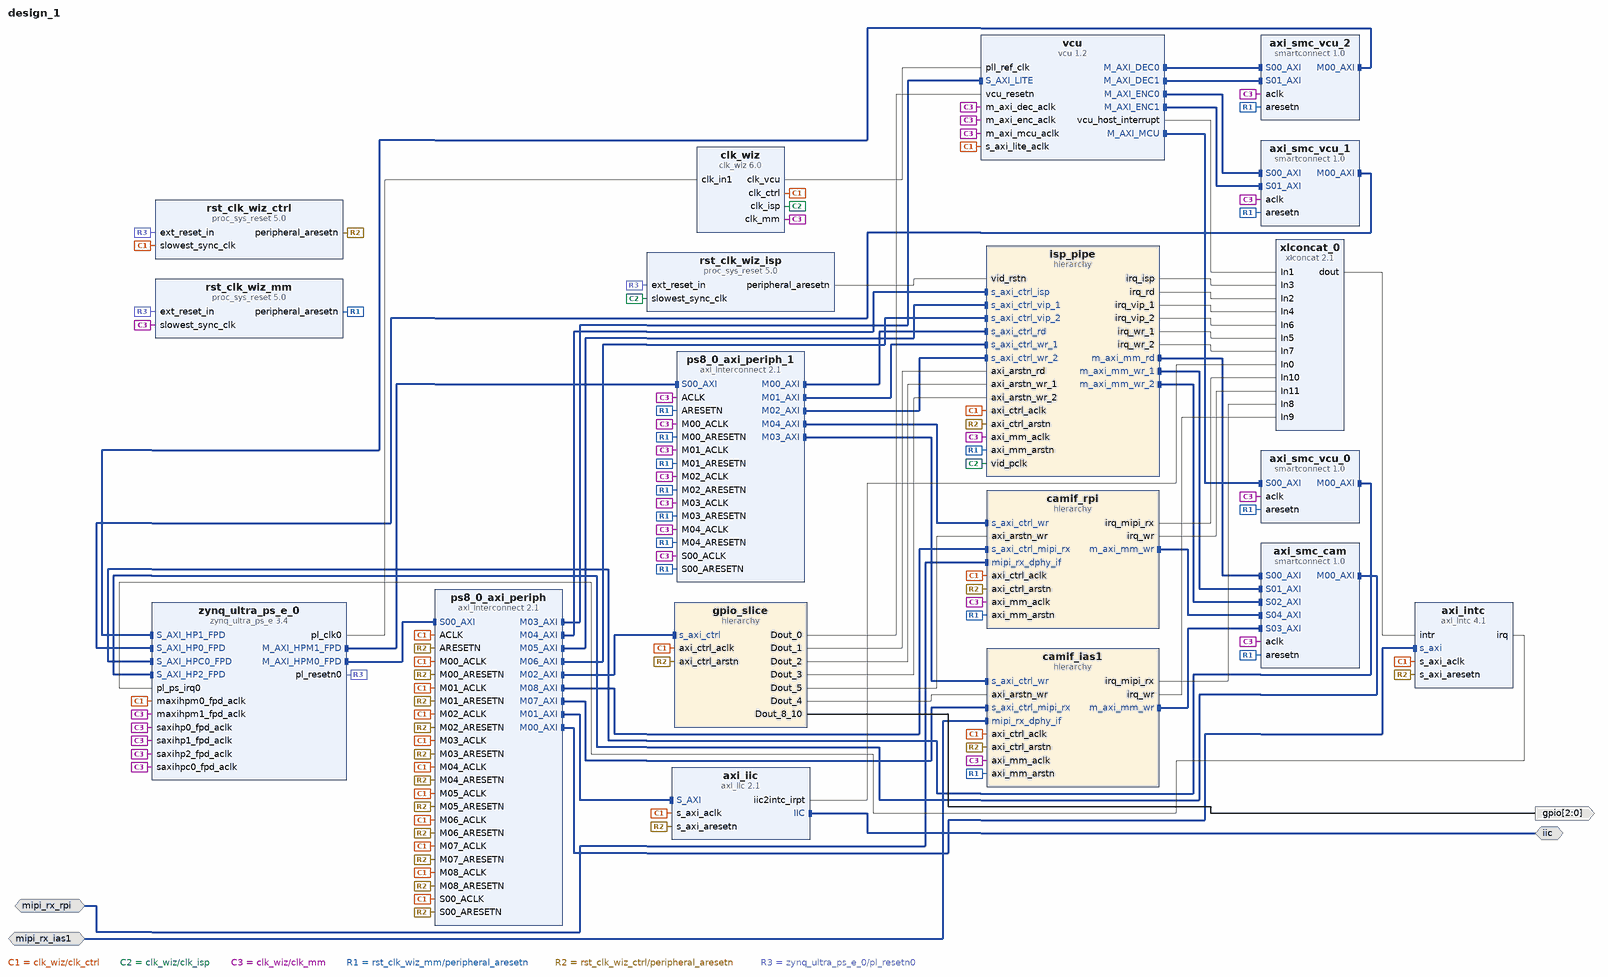
[diagram p0: block diagram of the top level]
# Vivado block design design_1, xck26-sfvc784-2LV-c, Vivado 2022.1
create_bd_design design_1

create_bd_intf_port -mode Master -vlnv xilinx.com:interface:iic_rtl:1.0 iic
create_bd_intf_port -mode Slave -vlnv xilinx.com:interface:mipi_phy_rtl:1.0 mipi_rx_ias1
create_bd_intf_port -mode Slave -vlnv xilinx.com:interface:mipi_phy_rtl:1.0 mipi_rx_rpi
create_bd_port -dir O -from 2 -to 0 gpio

create_bd_cell -type ip -vlnv xilinx.com:ip:xlconcat:2.1 xlconcat_0
set_property -dict {CONFIG.NUM_PORTS 12} [get_bd_cells xlconcat_0]
create_bd_cell -type hier camif_ias1
create_bd_cell -type hier isp_pipe
create_bd_cell -type hier camif_rpi
create_bd_cell -type ip -vlnv xilinx.com:ip:axi_intc:4.1 axi_intc
create_bd_cell -type ip -vlnv xilinx.com:ip:axi_iic:2.1 axi_iic
create_bd_cell -type ip -vlnv xilinx.com:ip:zynq_ultra_ps_e:3.4 zynq_ultra_ps_e_0
set_property -dict [list \
  CONFIG.CAN0_BOARD_INTERFACE custom \
  CONFIG.CAN1_BOARD_INTERFACE custom \
  CONFIG.CSU_BOARD_INTERFACE custom \
  CONFIG.DP_BOARD_INTERFACE custom \
  CONFIG.GEM0_BOARD_INTERFACE custom \
  CONFIG.GEM1_BOARD_INTERFACE custom \
  CONFIG.GEM2_BOARD_INTERFACE custom \
  CONFIG.GEM3_BOARD_INTERFACE custom \
  CONFIG.GPIO_BOARD_INTERFACE custom \
  CONFIG.IIC0_BOARD_INTERFACE custom \
  CONFIG.IIC1_BOARD_INTERFACE custom \
  CONFIG.NAND_BOARD_INTERFACE custom \
  CONFIG.PCIE_BOARD_INTERFACE custom \
  CONFIG.PJTAG_BOARD_INTERFACE custom \
  CONFIG.PMU_BOARD_INTERFACE custom \
  CONFIG.PSU_BANK_0_IO_STANDARD LVCMOS18 \
  CONFIG.PSU_BANK_1_IO_STANDARD LVCMOS18 \
  CONFIG.PSU_BANK_2_IO_STANDARD LVCMOS18 \
  CONFIG.PSU_BANK_3_IO_STANDARD LVCMOS18 \
  CONFIG.PSU_USB3__DUAL_CLOCK_ENABLE 1 \
  CONFIG.PSU__CAN1__PERIPHERAL__ENABLE 0 \
  CONFIG.PSU__CRF_APB__ACPU_CTRL__FREQMHZ 1333.333 \
  CONFIG.PSU__CRF_APB__ACPU_CTRL__SRCSEL APLL \
  CONFIG.PSU__CRF_APB__APLL_CTRL__SRCSEL PSS_REF_CLK \
  CONFIG.PSU__CRF_APB__APLL_FRAC_CFG__ENABLED 1 \
  CONFIG.PSU__CRF_APB__DBG_FPD_CTRL__FREQMHZ 250 \
  CONFIG.PSU__CRF_APB__DBG_FPD_CTRL__SRCSEL IOPLL \
  CONFIG.PSU__CRF_APB__DBG_TRACE_CTRL__FREQMHZ 250 \
  CONFIG.PSU__CRF_APB__DBG_TRACE_CTRL__SRCSEL IOPLL \
  CONFIG.PSU__CRF_APB__DBG_TSTMP_CTRL__FREQMHZ 250 \
  CONFIG.PSU__CRF_APB__DBG_TSTMP_CTRL__SRCSEL IOPLL \
  CONFIG.PSU__CRF_APB__DDR_CTRL__FREQMHZ 1200 \
  CONFIG.PSU__CRF_APB__DDR_CTRL__SRCSEL DPLL \
  CONFIG.PSU__CRF_APB__DPDMA_REF_CTRL__FREQMHZ 600 \
  CONFIG.PSU__CRF_APB__DPDMA_REF_CTRL__SRCSEL APLL \
  CONFIG.PSU__CRF_APB__DPLL_CTRL__SRCSEL PSS_REF_CLK \
  CONFIG.PSU__CRF_APB__DP_AUDIO_REF_CTRL__SRCSEL RPLL \
  CONFIG.PSU__CRF_APB__DP_STC_REF_CTRL__SRCSEL RPLL \
  CONFIG.PSU__CRF_APB__DP_VIDEO_REF_CTRL__SRCSEL VPLL \
  CONFIG.PSU__CRF_APB__GDMA_REF_CTRL__FREQMHZ 600 \
  CONFIG.PSU__CRF_APB__GDMA_REF_CTRL__SRCSEL DPLL \
  CONFIG.PSU__CRF_APB__GPU_REF_CTRL__FREQMHZ 600 \
  CONFIG.PSU__CRF_APB__GPU_REF_CTRL__SRCSEL IOPLL \
  CONFIG.PSU__CRF_APB__TOPSW_LSBUS_CTRL__FREQMHZ 100 \
  CONFIG.PSU__CRF_APB__TOPSW_LSBUS_CTRL__SRCSEL IOPLL \
  CONFIG.PSU__CRF_APB__TOPSW_MAIN_CTRL__FREQMHZ 533.33 \
  CONFIG.PSU__CRF_APB__TOPSW_MAIN_CTRL__SRCSEL DPLL \
  CONFIG.PSU__CRF_APB__VPLL_CTRL__SRCSEL PSS_REF_CLK \
  CONFIG.PSU__CRL_APB__ADMA_REF_CTRL__FREQMHZ 500 \
  CONFIG.PSU__CRL_APB__ADMA_REF_CTRL__SRCSEL IOPLL \
  CONFIG.PSU__CRL_APB__CAN1_REF_CTRL__FREQMHZ 100 \
  CONFIG.PSU__CRL_APB__CAN1_REF_CTRL__SRCSEL IOPLL \
  CONFIG.PSU__CRL_APB__CPU_R5_CTRL__FREQMHZ 533.333 \
  CONFIG.PSU__CRL_APB__CPU_R5_CTRL__SRCSEL RPLL \
  CONFIG.PSU__CRL_APB__DBG_LPD_CTRL__FREQMHZ 250 \
  CONFIG.PSU__CRL_APB__DBG_LPD_CTRL__SRCSEL IOPLL \
  CONFIG.PSU__CRL_APB__GEM3_REF_CTRL__FREQMHZ 125 \
  CONFIG.PSU__CRL_APB__GEM3_REF_CTRL__SRCSEL IOPLL \
  CONFIG.PSU__CRL_APB__I2C0_REF_CTRL__FREQMHZ 100 \
  CONFIG.PSU__CRL_APB__I2C0_REF_CTRL__SRCSEL IOPLL \
  CONFIG.PSU__CRL_APB__I2C1_REF_CTRL__FREQMHZ 100 \
  CONFIG.PSU__CRL_APB__I2C1_REF_CTRL__SRCSEL IOPLL \
  CONFIG.PSU__CRL_APB__IOPLL_CTRL__SRCSEL PSS_REF_CLK \
  CONFIG.PSU__CRL_APB__IOU_SWITCH_CTRL__FREQMHZ 250 \
  CONFIG.PSU__CRL_APB__IOU_SWITCH_CTRL__SRCSEL IOPLL \
  CONFIG.PSU__CRL_APB__LPD_LSBUS_CTRL__FREQMHZ 100 \
  CONFIG.PSU__CRL_APB__LPD_LSBUS_CTRL__SRCSEL IOPLL \
  CONFIG.PSU__CRL_APB__LPD_SWITCH_CTRL__FREQMHZ 500 \
  CONFIG.PSU__CRL_APB__LPD_SWITCH_CTRL__SRCSEL IOPLL \
  CONFIG.PSU__CRL_APB__PCAP_CTRL__FREQMHZ 200 \
  CONFIG.PSU__CRL_APB__PCAP_CTRL__SRCSEL IOPLL \
  CONFIG.PSU__CRL_APB__PL0_REF_CTRL__FREQMHZ 100 \
  CONFIG.PSU__CRL_APB__PL0_REF_CTRL__SRCSEL IOPLL \
  CONFIG.PSU__CRL_APB__QSPI_REF_CTRL__FREQMHZ 125 \
  CONFIG.PSU__CRL_APB__QSPI_REF_CTRL__SRCSEL IOPLL \
  CONFIG.PSU__CRL_APB__RPLL_CTRL__SRCSEL PSS_REF_CLK \
  CONFIG.PSU__CRL_APB__SDIO1_REF_CTRL__FREQMHZ 200 \
  CONFIG.PSU__CRL_APB__SDIO1_REF_CTRL__SRCSEL IOPLL \
  CONFIG.PSU__CRL_APB__SPI1_REF_CTRL__SRCSEL IOPLL \
  CONFIG.PSU__CRL_APB__TIMESTAMP_REF_CTRL__FREQMHZ 100 \
  CONFIG.PSU__CRL_APB__TIMESTAMP_REF_CTRL__SRCSEL IOPLL \
  CONFIG.PSU__CRL_APB__UART0_REF_CTRL__FREQMHZ 100 \
  CONFIG.PSU__CRL_APB__UART0_REF_CTRL__SRCSEL IOPLL \
  CONFIG.PSU__CRL_APB__UART1_REF_CTRL__FREQMHZ 100 \
  CONFIG.PSU__CRL_APB__UART1_REF_CTRL__SRCSEL IOPLL \
  CONFIG.PSU__CRL_APB__USB0_BUS_REF_CTRL__FREQMHZ 250 \
  CONFIG.PSU__CRL_APB__USB0_BUS_REF_CTRL__SRCSEL IOPLL \
  CONFIG.PSU__CRL_APB__USB3_DUAL_REF_CTRL__FREQMHZ 20 \
  CONFIG.PSU__CRL_APB__USB3_DUAL_REF_CTRL__SRCSEL IOPLL \
  CONFIG.PSU__CRL_APB__USB3__ENABLE 1 \
  CONFIG.PSU__CSUPMU__PERIPHERAL__VALID 1 \
  CONFIG.PSU__DDRC__BUS_WIDTH {64 Bit} \
  CONFIG.PSU__DDRC__COMPONENTS Components \
  CONFIG.PSU__DDRC__DEVICE_CAPACITY {8192 MBits} \
  CONFIG.PSU__DDRC__DRAM_WIDTH {16 Bits} \
  CONFIG.PSU__DDRC__ECC Disabled \
  CONFIG.PSU__DDRC__MEMORY_TYPE {DDR 4} \
  CONFIG.PSU__DDRC__SPEED_BIN DDR4_2400R \
  CONFIG.PSU__DDR_HIGH_ADDRESS_GUI_ENABLE 1 \
  CONFIG.PSU__DDR__INTERFACE__FREQMHZ 600.000 \
  CONFIG.PSU__DEVICE_TYPE EV \
  CONFIG.PSU__DISPLAYPORT__LANE0__ENABLE 1 \
  CONFIG.PSU__DISPLAYPORT__LANE0__IO {GT Lane1} \
  CONFIG.PSU__DISPLAYPORT__LANE1__ENABLE 1 \
  CONFIG.PSU__DISPLAYPORT__LANE1__IO {GT Lane0} \
  CONFIG.PSU__DISPLAYPORT__PERIPHERAL__ENABLE 1 \
  CONFIG.PSU__DLL__ISUSED 1 \
  CONFIG.PSU__DPAUX__PERIPHERAL__ENABLE 1 \
  CONFIG.PSU__DPAUX__PERIPHERAL__IO {MIO 27 .. 30} \
  CONFIG.PSU__DP__LANE_SEL {Dual Lower} \
  CONFIG.PSU__DP__REF_CLK_FREQ 27 \
  CONFIG.PSU__DP__REF_CLK_SEL {Ref Clk0} \
  CONFIG.PSU__ENET3__FIFO__ENABLE 0 \
  CONFIG.PSU__ENET3__GRP_MDIO__ENABLE 1 \
  CONFIG.PSU__ENET3__GRP_MDIO__IO {MIO 76 .. 77} \
  CONFIG.PSU__ENET3__PERIPHERAL__ENABLE 1 \
  CONFIG.PSU__ENET3__PERIPHERAL__IO {MIO 64 .. 75} \
  CONFIG.PSU__ENET3__PTP__ENABLE 0 \
  CONFIG.PSU__ENET3__TSU__ENABLE 0 \
  CONFIG.PSU__FPGA_PL0_ENABLE 1 \
  CONFIG.PSU__GEM3_COHERENCY 0 \
  CONFIG.PSU__GEM3_ROUTE_THROUGH_FPD 0 \
  CONFIG.PSU__GEM__TSU__ENABLE 0 \
  CONFIG.PSU__GPIO0_MIO__IO {MIO 0 .. 25} \
  CONFIG.PSU__GPIO0_MIO__PERIPHERAL__ENABLE 1 \
  CONFIG.PSU__GPIO1_MIO__IO {MIO 26 .. 51} \
  CONFIG.PSU__GPIO1_MIO__PERIPHERAL__ENABLE 1 \
  CONFIG.PSU__GPIO_EMIO_WIDTH 3 \
  CONFIG.PSU__GT__LINK_SPEED HBR \
  CONFIG.PSU__GT__PRE_EMPH_LVL_4 0 \
  CONFIG.PSU__GT__VLT_SWNG_LVL_4 0 \
  CONFIG.PSU__I2C0__PERIPHERAL__ENABLE 0 \
  CONFIG.PSU__I2C1__PERIPHERAL__ENABLE 1 \
  CONFIG.PSU__I2C1__PERIPHERAL__IO {MIO 24 .. 25} \
  CONFIG.PSU__IOU_SLCR__IOU_TTC_APB_CLK__TTC0_SEL APB \
  CONFIG.PSU__IOU_SLCR__IOU_TTC_APB_CLK__TTC1_SEL APB \
  CONFIG.PSU__IOU_SLCR__IOU_TTC_APB_CLK__TTC2_SEL APB \
  CONFIG.PSU__IOU_SLCR__IOU_TTC_APB_CLK__TTC3_SEL APB \
  CONFIG.PSU__MAXIGP0__DATA_WIDTH 128 \
  CONFIG.PSU__OVERRIDE_HPX_QOS 0 \
  CONFIG.PSU__OVERRIDE__BASIC_CLOCK 0 \
  CONFIG.PSU__PMU_COHERENCY 0 \
  CONFIG.PSU__PMU__AIBACK__ENABLE 0 \
  CONFIG.PSU__PMU__EMIO_GPI__ENABLE 0 \
  CONFIG.PSU__PMU__EMIO_GPO__ENABLE 0 \
  CONFIG.PSU__PMU__GPI0__ENABLE 1 \
  CONFIG.PSU__PMU__GPI0__IO {MIO 26} \
  CONFIG.PSU__PMU__GPI1__ENABLE 0 \
  CONFIG.PSU__PMU__GPI2__ENABLE 0 \
  CONFIG.PSU__PMU__GPI3__ENABLE 0 \
  CONFIG.PSU__PMU__GPI4__ENABLE 0 \
  CONFIG.PSU__PMU__GPI5__ENABLE 1 \
  CONFIG.PSU__PMU__GPI5__IO {MIO 31} \
  CONFIG.PSU__PMU__GPO0__ENABLE 1 \
  CONFIG.PSU__PMU__GPO0__IO {MIO 32} \
  CONFIG.PSU__PMU__GPO1__ENABLE 1 \
  CONFIG.PSU__PMU__GPO1__IO {MIO 33} \
  CONFIG.PSU__PMU__GPO2__ENABLE 1 \
  CONFIG.PSU__PMU__GPO2__IO {MIO 34} \
  CONFIG.PSU__PMU__GPO2__POLARITY high \
  CONFIG.PSU__PMU__GPO3__ENABLE 1 \
  CONFIG.PSU__PMU__GPO3__IO {MIO 35} \
  CONFIG.PSU__PMU__GPO3__POLARITY low \
  CONFIG.PSU__PMU__GPO4__ENABLE 0 \
  CONFIG.PSU__PMU__GPO5__ENABLE 0 \
  CONFIG.PSU__PMU__PERIPHERAL__ENABLE 1 \
  CONFIG.PSU__PMU__PLERROR__ENABLE 0 \
  CONFIG.PSU__PRESET_APPLIED 1 \
  CONFIG.PSU__PSS_REF_CLK__FREQMHZ 33.333 \
  CONFIG.PSU__QSPI_COHERENCY 0 \
  CONFIG.PSU__QSPI_ROUTE_THROUGH_FPD 0 \
  CONFIG.PSU__QSPI__GRP_FBCLK__ENABLE 0 \
  CONFIG.PSU__QSPI__PERIPHERAL__DATA_MODE x4 \
  CONFIG.PSU__QSPI__PERIPHERAL__ENABLE 1 \
  CONFIG.PSU__QSPI__PERIPHERAL__IO {MIO 0 .. 5} \
  CONFIG.PSU__QSPI__PERIPHERAL__MODE Single \
  CONFIG.PSU__SATA__PERIPHERAL__ENABLE 0 \
  CONFIG.PSU__SD0__CLK_100_SDR_OTAP_DLY 0x00 \
  CONFIG.PSU__SD0__CLK_200_SDR_OTAP_DLY 0x00 \
  CONFIG.PSU__SD0__CLK_50_DDR_ITAP_DLY 0x00 \
  CONFIG.PSU__SD0__CLK_50_DDR_OTAP_DLY 0x00 \
  CONFIG.PSU__SD0__CLK_50_SDR_ITAP_DLY 0x00 \
  CONFIG.PSU__SD0__CLK_50_SDR_OTAP_DLY 0x00 \
  CONFIG.PSU__SD1_COHERENCY 0 \
  CONFIG.PSU__SD1_ROUTE_THROUGH_FPD 0 \
  CONFIG.PSU__SD1__CLK_100_SDR_OTAP_DLY 0x3 \
  CONFIG.PSU__SD1__CLK_200_SDR_OTAP_DLY 0x3 \
  CONFIG.PSU__SD1__CLK_50_DDR_ITAP_DLY 0x3D \
  CONFIG.PSU__SD1__CLK_50_DDR_OTAP_DLY 0x4 \
  CONFIG.PSU__SD1__CLK_50_SDR_ITAP_DLY 0x15 \
  CONFIG.PSU__SD1__CLK_50_SDR_OTAP_DLY 0x5 \
  CONFIG.PSU__SD1__DATA_TRANSFER_MODE 8Bit \
  CONFIG.PSU__SD1__GRP_CD__ENABLE 1 \
  CONFIG.PSU__SD1__GRP_CD__IO {MIO 45} \
  CONFIG.PSU__SD1__GRP_POW__ENABLE 1 \
  CONFIG.PSU__SD1__GRP_POW__IO {MIO 43} \
  CONFIG.PSU__SD1__GRP_WP__ENABLE 0 \
  CONFIG.PSU__SD1__PERIPHERAL__ENABLE 1 \
  CONFIG.PSU__SD1__PERIPHERAL__IO {MIO 39 .. 51} \
  CONFIG.PSU__SD1__SLOT_TYPE {SD 3.0} \
  CONFIG.PSU__SPI1__GRP_SS0__IO {MIO 9} \
  CONFIG.PSU__SPI1__PERIPHERAL__ENABLE 1 \
  CONFIG.PSU__SPI1__PERIPHERAL__IO {MIO 6 .. 11} \
  CONFIG.PSU__SWDT0__CLOCK__ENABLE 0 \
  CONFIG.PSU__SWDT0__PERIPHERAL__ENABLE 1 \
  CONFIG.PSU__SWDT0__RESET__ENABLE 0 \
  CONFIG.PSU__SWDT1__CLOCK__ENABLE 0 \
  CONFIG.PSU__SWDT1__PERIPHERAL__ENABLE 1 \
  CONFIG.PSU__SWDT1__RESET__ENABLE 0 \
  CONFIG.PSU__TSU__BUFG_PORT_PAIR 0 \
  CONFIG.PSU__TTC0__CLOCK__ENABLE 0 \
  CONFIG.PSU__TTC0__PERIPHERAL__ENABLE 1 \
  CONFIG.PSU__TTC0__WAVEOUT__ENABLE 0 \
  CONFIG.PSU__TTC1__CLOCK__ENABLE 0 \
  CONFIG.PSU__TTC1__PERIPHERAL__ENABLE 1 \
  CONFIG.PSU__TTC1__WAVEOUT__ENABLE 0 \
  CONFIG.PSU__TTC2__CLOCK__ENABLE 0 \
  CONFIG.PSU__TTC2__PERIPHERAL__ENABLE 1 \
  CONFIG.PSU__TTC2__WAVEOUT__ENABLE 0 \
  CONFIG.PSU__TTC3__CLOCK__ENABLE 0 \
  CONFIG.PSU__TTC3__PERIPHERAL__ENABLE 1 \
  CONFIG.PSU__TTC3__WAVEOUT__ENABLE 0 \
  CONFIG.PSU__UART0__PERIPHERAL__ENABLE 0 \
  CONFIG.PSU__UART1__BAUD_RATE 115200 \
  CONFIG.PSU__UART1__MODEM__ENABLE 0 \
  CONFIG.PSU__UART1__PERIPHERAL__ENABLE 1 \
  CONFIG.PSU__UART1__PERIPHERAL__IO {MIO 36 .. 37} \
  CONFIG.PSU__USB0_COHERENCY 0 \
  CONFIG.PSU__USB0__PERIPHERAL__ENABLE 1 \
  CONFIG.PSU__USB0__PERIPHERAL__IO {MIO 52 .. 63} \
  CONFIG.PSU__USB0__REF_CLK_FREQ 26 \
  CONFIG.PSU__USB0__REF_CLK_SEL {Ref Clk1} \
  CONFIG.PSU__USB2_0__EMIO__ENABLE 0 \
  CONFIG.PSU__USB3_0__EMIO__ENABLE 0 \
  CONFIG.PSU__USB3_0__PERIPHERAL__ENABLE 1 \
  CONFIG.PSU__USB3_0__PERIPHERAL__IO {GT Lane2} \
  CONFIG.PSU__USB__RESET__MODE {Boot Pin} \
  CONFIG.PSU__USB__RESET__POLARITY {Active Low} \
  CONFIG.PSU__USE__IRQ0 1 \
  CONFIG.PSU__USE__M_AXI_GP0 1 \
  CONFIG.PSU__USE__M_AXI_GP1 1 \
  CONFIG.PSU__USE__M_AXI_GP2 0 \
  CONFIG.PSU__USE__S_AXI_GP0 1 \
  CONFIG.PSU__USE__S_AXI_GP2 1 \
  CONFIG.PSU__USE__S_AXI_GP3 1 \
  CONFIG.PSU__USE__S_AXI_GP4 1 \
  CONFIG.QSPI_BOARD_INTERFACE custom \
  CONFIG.SATA_BOARD_INTERFACE custom \
  CONFIG.SD0_BOARD_INTERFACE custom \
  CONFIG.SD1_BOARD_INTERFACE custom \
  CONFIG.SPI0_BOARD_INTERFACE custom \
  CONFIG.SPI1_BOARD_INTERFACE custom \
  CONFIG.SUBPRESET1 Custom \
  CONFIG.SUBPRESET2 Custom \
  CONFIG.SWDT0_BOARD_INTERFACE custom \
  CONFIG.SWDT1_BOARD_INTERFACE custom \
  CONFIG.TRACE_BOARD_INTERFACE custom \
  CONFIG.TTC0_BOARD_INTERFACE custom \
  CONFIG.TTC1_BOARD_INTERFACE custom \
  CONFIG.TTC2_BOARD_INTERFACE custom \
  CONFIG.TTC3_BOARD_INTERFACE custom \
  CONFIG.UART0_BOARD_INTERFACE custom \
  CONFIG.UART1_BOARD_INTERFACE custom \
  CONFIG.USB0_BOARD_INTERFACE custom \
  CONFIG.USB1_BOARD_INTERFACE custom \
] [get_bd_cells zynq_ultra_ps_e_0]
# 740 more settings of zynq_ultra_ps_e_0 are not shown: defaults, MIO pin electricals, DDR timing, and values the tool derives
create_bd_cell -type ip -vlnv xilinx.com:ip:clk_wiz:6.0 clk_wiz
set_property -dict [list \
  CONFIG.CLKOUT1_JITTER 96.285 \
  CONFIG.CLKOUT1_PHASE_ERROR 76.968 \
  CONFIG.CLKOUT1_REQUESTED_OUT_FREQ 100 \
  CONFIG.CLKOUT2_JITTER 79.342 \
  CONFIG.CLKOUT2_PHASE_ERROR 76.968 \
  CONFIG.CLKOUT2_REQUESTED_OUT_FREQ 300 \
  CONFIG.CLKOUT2_USED true \
  CONFIG.CLKOUT3_JITTER 92.549 \
  CONFIG.CLKOUT3_PHASE_ERROR 76.968 \
  CONFIG.CLKOUT3_REQUESTED_OUT_FREQ 125 \
  CONFIG.CLKOUT3_USED true \
  CONFIG.CLKOUT4_JITTER 117.170 \
  CONFIG.CLKOUT4_PHASE_ERROR 76.968 \
  CONFIG.CLKOUT4_REQUESTED_OUT_FREQ 33.3 \
  CONFIG.CLKOUT4_USED true \
  CONFIG.CLK_OUT1_PORT clk_ctrl \
  CONFIG.CLK_OUT2_PORT clk_mm \
  CONFIG.CLK_OUT3_PORT clk_isp \
  CONFIG.CLK_OUT4_PORT clk_vcu \
  CONFIG.MMCM_CLKFBOUT_MULT_F 15.000 \
  CONFIG.MMCM_CLKOUT0_DIVIDE_F 15.000 \
  CONFIG.MMCM_CLKOUT1_DIVIDE 5 \
  CONFIG.MMCM_CLKOUT2_DIVIDE 12 \
  CONFIG.MMCM_CLKOUT3_DIVIDE 45 \
  CONFIG.MMCM_DIVCLK_DIVIDE 1 \
  CONFIG.NUM_OUT_CLKS 4 \
  CONFIG.USE_LOCKED false \
  CONFIG.USE_RESET false \
] [get_bd_cells clk_wiz]
create_bd_cell -type hier gpio_slice
create_bd_cell -type ip -vlnv xilinx.com:ip:vcu:1.2 vcu
set_property -dict [list \
  CONFIG.DEC_CODING_TYPE 1 \
  CONFIG.DEC_COLOR_DEPTH 0 \
  CONFIG.DEC_COLOR_FORMAT 0 \
  CONFIG.ENC_BUFFER_EN true \
  CONFIG.ENC_BUFFER_SIZE_ACTUAL 392 \
  CONFIG.ENC_CODING_TYPE 1 \
  CONFIG.ENC_COLOR_DEPTH 0 \
  CONFIG.ENC_COLOR_FORMAT 0 \
  CONFIG.ENC_MEM_URAM_USED 392 \
  CONFIG.TABLE_NO 2 \
] [get_bd_cells vcu]
create_bd_cell -type ip -vlnv xilinx.com:ip:axi_interconnect:2.1 ps8_0_axi_periph
set_property -dict {CONFIG.NUM_MI 9} [get_bd_cells ps8_0_axi_periph]
create_bd_cell -type ip -vlnv xilinx.com:ip:proc_sys_reset:5.0 rst_clk_wiz_ctrl
create_bd_cell -type ip -vlnv xilinx.com:ip:smartconnect:1.0 axi_smc_vcu_0
set_property -dict {CONFIG.NUM_SI 1} [get_bd_cells axi_smc_vcu_0]
create_bd_cell -type ip -vlnv xilinx.com:ip:proc_sys_reset:5.0 rst_clk_wiz_mm
create_bd_cell -type ip -vlnv xilinx.com:ip:smartconnect:1.0 axi_smc_vcu_1
set_property -dict {CONFIG.NUM_SI 2} [get_bd_cells axi_smc_vcu_1]
create_bd_cell -type ip -vlnv xilinx.com:ip:smartconnect:1.0 axi_smc_vcu_2
set_property -dict {CONFIG.NUM_SI 2} [get_bd_cells axi_smc_vcu_2]
create_bd_cell -type ip -vlnv xilinx.com:ip:axi_interconnect:2.1 ps8_0_axi_periph_1
set_property -dict {CONFIG.NUM_MI 5} [get_bd_cells ps8_0_axi_periph_1]
create_bd_cell -type ip -vlnv xilinx.com:ip:smartconnect:1.0 axi_smc_cam
set_property -dict {CONFIG.NUM_CLKS 1 CONFIG.NUM_SI 5} [get_bd_cells axi_smc_cam]
create_bd_cell -type ip -vlnv xilinx.com:ip:proc_sys_reset:5.0 rst_clk_wiz_isp

# ---- hierarchy /camif_ias1 ----
current_bd_instance /camif_ias1
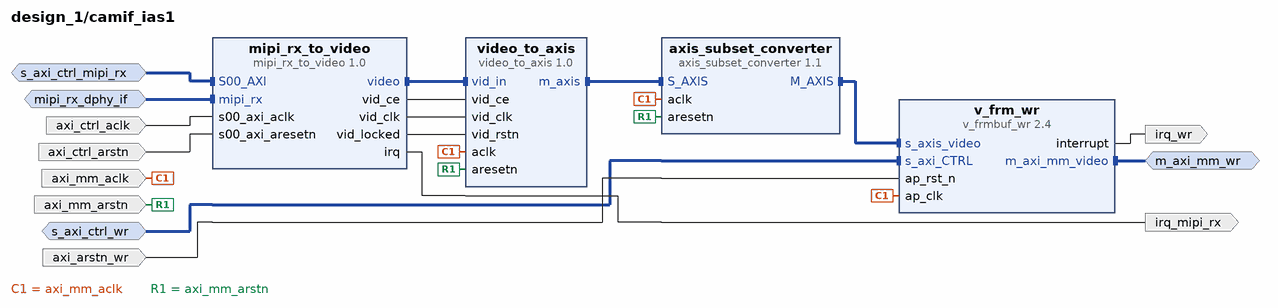
[diagram p1: block diagram inside /camif_ias1]
create_bd_intf_pin -mode Slave -vlnv xilinx.com:interface:mipi_phy_rtl:1.0 mipi_rx_dphy_if
create_bd_intf_pin -mode Slave -vlnv xilinx.com:interface:aximm_rtl:1.0 s_axi_ctrl_wr
create_bd_intf_pin -mode Master -vlnv xilinx.com:interface:aximm_rtl:1.0 m_axi_mm_wr
create_bd_intf_pin -mode Slave -vlnv xilinx.com:interface:aximm_rtl:1.0 s_axi_ctrl_mipi_rx
create_bd_pin -dir O -type intr irq_wr
create_bd_pin -dir I -type clk axi_ctrl_aclk
create_bd_pin -dir I -type rst axi_ctrl_arstn
create_bd_pin -dir O -type intr irq_mipi_rx
create_bd_pin -dir I -type rst axi_arstn_wr
create_bd_pin -dir I -type clk axi_mm_aclk
create_bd_pin -dir I -type rst axi_mm_arstn

create_bd_cell -type ip -vlnv xilinx.com:ip:axis_subset_converter:1.1 axis_subset_converter
set_property -dict [list \
  CONFIG.M_HAS_TLAST 1 \
  CONFIG.M_HAS_TREADY 1 \
  CONFIG.M_TDATA_NUM_BYTES 15 \
  CONFIG.M_TUSER_WIDTH 1 \
  CONFIG.S_HAS_TLAST 1 \
  CONFIG.S_HAS_TREADY 1 \
  CONFIG.S_TDATA_NUM_BYTES 5 \
  CONFIG.S_TUSER_WIDTH 1 \
  CONFIG.TDATA_REMAP {20'b0,tdata[39:30],20'b0,tdata[29:20],20'b0,tdata[19:10],20'b0,tdata[9:0]} \
  CONFIG.TLAST_REMAP {tlast[0]} \
  CONFIG.TUSER_REMAP {tuser[0:0]} \
] [get_bd_cells axis_subset_converter]
create_bd_cell -type ip -vlnv xilinx.com:ip:v_frmbuf_wr:2.4 v_frm_wr
set_property -dict [list \
  CONFIG.AXIMM_DATA_WIDTH 256 \
  CONFIG.C_M_AXI_MM_VIDEO_DATA_WIDTH 256 \
  CONFIG.HAS_BGR8 0 \
  CONFIG.HAS_BGRX8 0 \
  CONFIG.HAS_RGB8 0 \
  CONFIG.HAS_RGBX8 0 \
  CONFIG.HAS_Y8 1 \
  CONFIG.HAS_Y10 1 \
  CONFIG.MAX_COLS 4208 \
  CONFIG.MAX_DATA_WIDTH 10 \
  CONFIG.MAX_ROWS 3120 \
  CONFIG.SAMPLES_PER_CLOCK 4 \
] [get_bd_cells v_frm_wr]
create_bd_cell -type ip -vlnv bxq.com:user:mipi_rx_to_video:1.0 mipi_rx_to_video
set_property -dict [list \
  CONFIG.DATA_BITS 10 \
  CONFIG.DATA_DELAY_INSIDE true \
  CONFIG.DATA_DELAY_NTAPS 200 \
  CONFIG.HS_SETTLE_DELAY 20 \
  CONFIG.LANES_NUM 4 \
] [get_bd_cells mipi_rx_to_video]
create_bd_cell -type ip -vlnv bxq.com:user:video_to_axis:1.0 video_to_axis
set_property -dict {CONFIG.ADDR_BITS 10 CONFIG.DATA_BITS 40} [get_bd_cells video_to_axis]

# ---- hierarchy /isp_pipe ----
current_bd_instance /isp_pipe
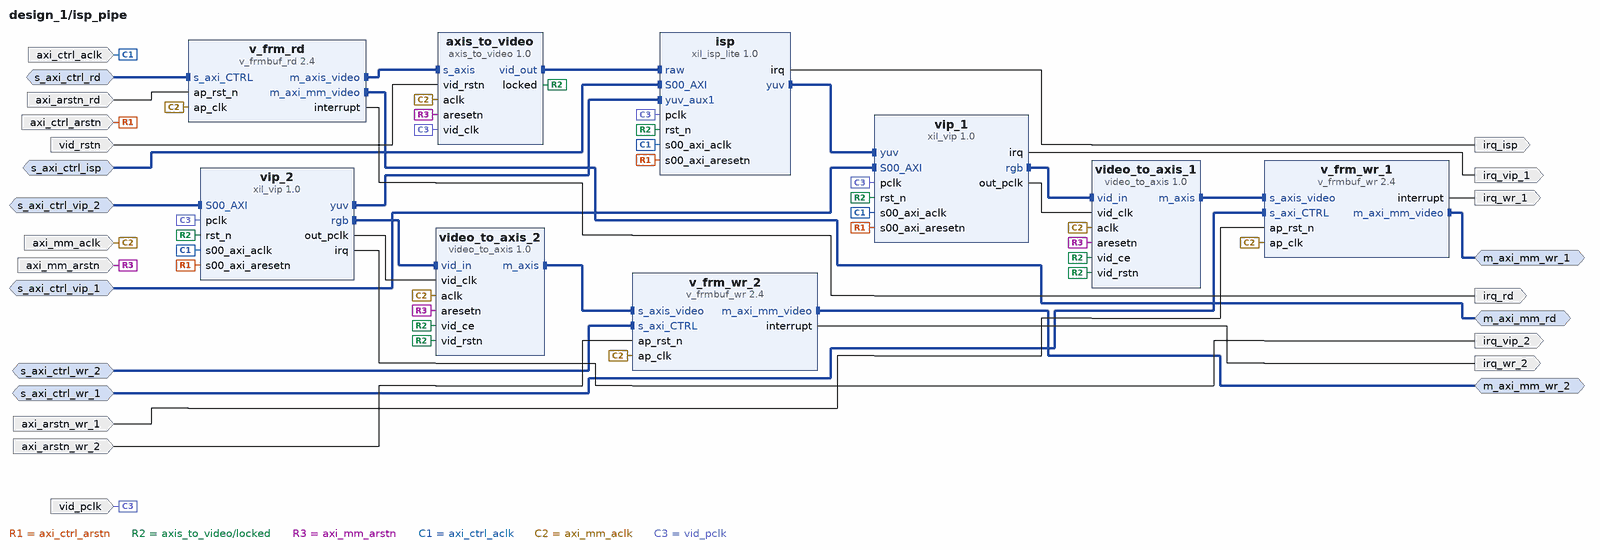
[diagram p2: block diagram inside /isp_pipe]
create_bd_intf_pin -mode Slave -vlnv xilinx.com:interface:aximm_rtl:1.0 s_axi_ctrl_vip_1
create_bd_intf_pin -mode Slave -vlnv xilinx.com:interface:aximm_rtl:1.0 s_axi_ctrl_rd
create_bd_intf_pin -mode Master -vlnv xilinx.com:interface:aximm_rtl:1.0 m_axi_mm_rd
create_bd_intf_pin -mode Slave -vlnv xilinx.com:interface:aximm_rtl:1.0 s_axi_ctrl_isp
create_bd_intf_pin -mode Slave -vlnv xilinx.com:interface:aximm_rtl:1.0 s_axi_ctrl_wr_1
create_bd_intf_pin -mode Master -vlnv xilinx.com:interface:aximm_rtl:1.0 m_axi_mm_wr_1
create_bd_intf_pin -mode Slave -vlnv xilinx.com:interface:aximm_rtl:1.0 s_axi_ctrl_vip_2
create_bd_intf_pin -mode Slave -vlnv xilinx.com:interface:aximm_rtl:1.0 s_axi_ctrl_wr_2
create_bd_intf_pin -mode Master -vlnv xilinx.com:interface:aximm_rtl:1.0 m_axi_mm_wr_2
create_bd_pin -dir I -type clk vid_pclk
create_bd_pin -dir O -type intr irq_vip_1
create_bd_pin -dir I -type clk axi_mm_aclk
create_bd_pin -dir I -type rst axi_mm_arstn
create_bd_pin -dir O -type intr irq_rd
create_bd_pin -dir O -type intr irq_isp
create_bd_pin -dir O -type intr irq_wr_1
create_bd_pin -dir I -type rst vid_rstn
create_bd_pin -dir I -type rst axi_arstn_rd
create_bd_pin -dir I -type rst axi_arstn_wr_1
create_bd_pin -dir I -type clk axi_ctrl_aclk
create_bd_pin -dir I -type rst axi_ctrl_arstn
create_bd_pin -dir O -type intr irq_vip_2
create_bd_pin -dir I -type rst axi_arstn_wr_2
create_bd_pin -dir O -type intr irq_wr_2

create_bd_cell -type ip -vlnv bxq.com:user:axis_to_video:1.0 axis_to_video
set_property -dict [list \
  CONFIG.ADDR_BITS 11 \
  CONFIG.DATA_BITS 10 \
  CONFIG.H_DISP 2048 \
  CONFIG.H_POL 0 \
  CONFIG.V_DISP 1536 \
  CONFIG.V_POL 1 \
] [get_bd_cells axis_to_video]
create_bd_cell -type ip -vlnv xilinx.com:ip:v_frmbuf_rd:2.4 v_frm_rd
set_property -dict [list \
  CONFIG.AXIMM_DATA_WIDTH 64 \
  CONFIG.C_M_AXI_MM_VIDEO_DATA_WIDTH 64 \
  CONFIG.HAS_RGB8 0 \
  CONFIG.HAS_Y8 1 \
  CONFIG.HAS_Y10 1 \
  CONFIG.MAX_DATA_WIDTH 10 \
  CONFIG.SAMPLES_PER_CLOCK 1 \
] [get_bd_cells v_frm_rd]
create_bd_cell -type ip -vlnv xilinx.com:ip:v_frmbuf_wr:2.4 v_frm_wr_1
set_property -dict [list \
  CONFIG.AXIMM_DATA_WIDTH 64 \
  CONFIG.C_M_AXI_MM_VIDEO_DATA_WIDTH 64 \
  CONFIG.HAS_BGR8 1 \
  CONFIG.HAS_RGB8 1 \
  CONFIG.HAS_UYVY8 1 \
  CONFIG.HAS_Y8 0 \
  CONFIG.HAS_YUYV8 1 \
  CONFIG.HAS_Y_UV8_420 1 \
  CONFIG.MAX_DATA_WIDTH 8 \
  CONFIG.MAX_NR_PLANES 2 \
  CONFIG.SAMPLES_PER_CLOCK 1 \
] [get_bd_cells v_frm_wr_1]
create_bd_cell -type ip -vlnv bxq.com:user:video_to_axis:1.0 video_to_axis_1
set_property -dict {CONFIG.ADDR_BITS 11 CONFIG.DATA_BITS 24} [get_bd_cells video_to_axis_1]
create_bd_cell -type ip -vlnv bxq.com:user:xil_vip:1.0 vip_1
set_property -dict {CONFIG.BITS 10 CONFIG.HEIGHT 1536 CONFIG.WIDTH 2048} [get_bd_cells vip_1]
create_bd_cell -type ip -vlnv bxq.com:user:xil_isp_lite:1.0 isp
set_property -dict {CONFIG.BAYER 1 CONFIG.HEIGHT 1536 CONFIG.IO_BITS 10 CONFIG.WIDTH 2048 CONFIG.YUV_AUX_NUM 1} [get_bd_cells isp]
create_bd_cell -type ip -vlnv bxq.com:user:xil_vip:1.0 vip_2
set_property -dict {CONFIG.BITS 10 CONFIG.HEIGHT 1536 CONFIG.WIDTH 2048} [get_bd_cells vip_2]
create_bd_cell -type ip -vlnv bxq.com:user:video_to_axis:1.0 video_to_axis_2
set_property -dict {CONFIG.ADDR_BITS 11 CONFIG.DATA_BITS 24} [get_bd_cells video_to_axis_2]
create_bd_cell -type ip -vlnv xilinx.com:ip:v_frmbuf_wr:2.4 v_frm_wr_2
set_property -dict [list \
  CONFIG.AXIMM_DATA_WIDTH 64 \
  CONFIG.C_M_AXI_MM_VIDEO_DATA_WIDTH 64 \
  CONFIG.HAS_BGR8 1 \
  CONFIG.HAS_UYVY8 1 \
  CONFIG.HAS_YUYV8 1 \
  CONFIG.HAS_Y_UV8_420 1 \
  CONFIG.MAX_NR_PLANES 2 \
  CONFIG.SAMPLES_PER_CLOCK 1 \
] [get_bd_cells v_frm_wr_2]

# ---- hierarchy /camif_rpi ----
current_bd_instance /camif_rpi
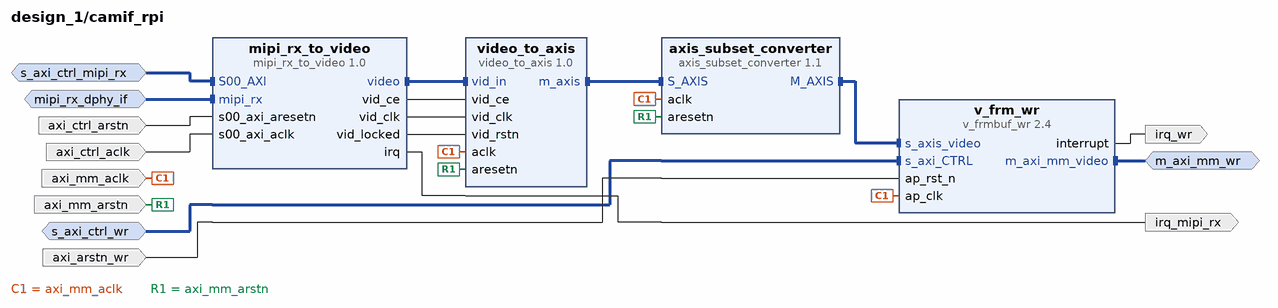
[diagram p3: block diagram inside /camif_rpi]
create_bd_intf_pin -mode Slave -vlnv xilinx.com:interface:mipi_phy_rtl:1.0 mipi_rx_dphy_if
create_bd_intf_pin -mode Slave -vlnv xilinx.com:interface:aximm_rtl:1.0 s_axi_ctrl_wr
create_bd_intf_pin -mode Master -vlnv xilinx.com:interface:aximm_rtl:1.0 m_axi_mm_wr
create_bd_intf_pin -mode Slave -vlnv xilinx.com:interface:aximm_rtl:1.0 s_axi_ctrl_mipi_rx
create_bd_pin -dir O -type intr irq_wr
create_bd_pin -dir I -type clk axi_mm_aclk
create_bd_pin -dir I -type rst axi_mm_arstn
create_bd_pin -dir O -type intr irq_mipi_rx
create_bd_pin -dir I -type rst axi_arstn_wr
create_bd_pin -dir I -type clk axi_ctrl_aclk
create_bd_pin -dir I -type rst axi_ctrl_arstn

create_bd_cell -type ip -vlnv xilinx.com:ip:axis_subset_converter:1.1 axis_subset_converter
set_property -dict [list \
  CONFIG.M_HAS_TLAST 1 \
  CONFIG.M_HAS_TREADY 1 \
  CONFIG.M_TDATA_NUM_BYTES 8 \
  CONFIG.M_TUSER_WIDTH 1 \
  CONFIG.S_HAS_TLAST 1 \
  CONFIG.S_HAS_TREADY 1 \
  CONFIG.S_TDATA_NUM_BYTES 3 \
  CONFIG.S_TUSER_WIDTH 1 \
  CONFIG.TDATA_REMAP {24'b0,tdata[19:10],20'b0,tdata[9:0]} \
  CONFIG.TLAST_REMAP {tlast[0]} \
  CONFIG.TUSER_REMAP {tuser[0:0]} \
] [get_bd_cells axis_subset_converter]
create_bd_cell -type ip -vlnv xilinx.com:ip:v_frmbuf_wr:2.4 v_frm_wr
set_property -dict [list \
  CONFIG.AXIMM_DATA_WIDTH 128 \
  CONFIG.C_M_AXI_MM_VIDEO_DATA_WIDTH 128 \
  CONFIG.HAS_BGR8 0 \
  CONFIG.HAS_BGRX8 0 \
  CONFIG.HAS_RGB8 0 \
  CONFIG.HAS_RGBX8 0 \
  CONFIG.HAS_Y8 1 \
  CONFIG.HAS_Y10 1 \
  CONFIG.MAX_DATA_WIDTH 10 \
  CONFIG.SAMPLES_PER_CLOCK 2 \
] [get_bd_cells v_frm_wr]
create_bd_cell -type ip -vlnv bxq.com:user:mipi_rx_to_video:1.0 mipi_rx_to_video
set_property -dict [list \
  CONFIG.DATA_BITS 10 \
  CONFIG.DATA_DELAY_INSIDE true \
  CONFIG.DATA_DELAY_NTAPS 200 \
  CONFIG.HS_SETTLE_DELAY 0 \
  CONFIG.LANES_NUM 2 \
] [get_bd_cells mipi_rx_to_video]
create_bd_cell -type ip -vlnv bxq.com:user:video_to_axis:1.0 video_to_axis
set_property -dict {CONFIG.ADDR_BITS 10 CONFIG.DATA_BITS 20} [get_bd_cells video_to_axis]

# ---- hierarchy /gpio_slice ----
current_bd_instance /gpio_slice
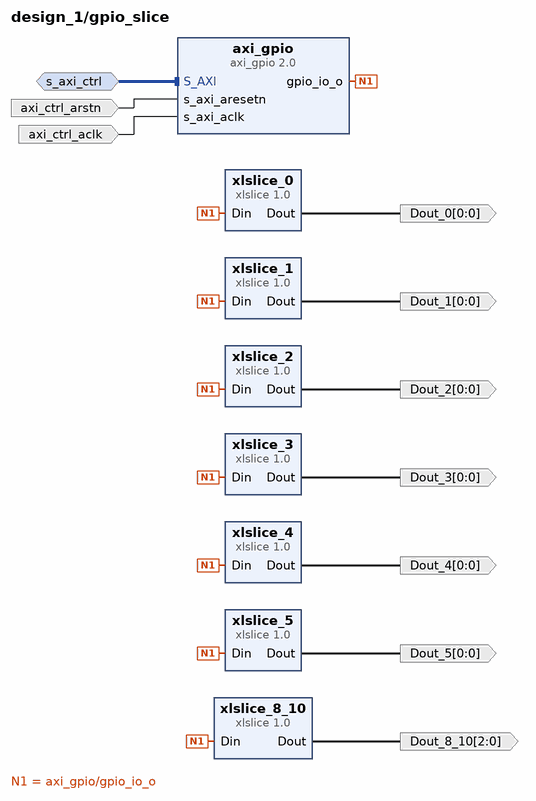
[diagram p4: block diagram inside /gpio_slice]
create_bd_intf_pin -mode Slave -vlnv xilinx.com:interface:aximm_rtl:1.0 s_axi_ctrl
create_bd_pin -dir O -from 2 -to 0 Dout_8_10
create_bd_pin -dir I -type clk axi_ctrl_aclk
create_bd_pin -dir I -type rst axi_ctrl_arstn
create_bd_pin -dir O -from 0 -to 0 Dout_2
create_bd_pin -dir O -from 0 -to 0 Dout_1
create_bd_pin -dir O -from 0 -to 0 Dout_0
create_bd_pin -dir O -from 0 -to 0 Dout_3
create_bd_pin -dir O -from 0 -to 0 Dout_4
create_bd_pin -dir O -from 0 -to 0 Dout_5

create_bd_cell -type ip -vlnv xilinx.com:ip:xlslice:1.0 xlslice_0
set_property -dict {CONFIG.DIN_WIDTH 16} [get_bd_cells xlslice_0]
create_bd_cell -type ip -vlnv xilinx.com:ip:xlslice:1.0 xlslice_1
set_property -dict {CONFIG.DIN_FROM 1 CONFIG.DIN_TO 1 CONFIG.DIN_WIDTH 16 CONFIG.DOUT_WIDTH 1} [get_bd_cells xlslice_1]
create_bd_cell -type ip -vlnv xilinx.com:ip:xlslice:1.0 xlslice_2
set_property -dict {CONFIG.DIN_FROM 2 CONFIG.DIN_TO 2 CONFIG.DIN_WIDTH 16 CONFIG.DOUT_WIDTH 1} [get_bd_cells xlslice_2]
create_bd_cell -type ip -vlnv xilinx.com:ip:xlslice:1.0 xlslice_3
set_property -dict {CONFIG.DIN_FROM 3 CONFIG.DIN_TO 3 CONFIG.DIN_WIDTH 16 CONFIG.DOUT_WIDTH 1} [get_bd_cells xlslice_3]
create_bd_cell -type ip -vlnv xilinx.com:ip:xlslice:1.0 xlslice_4
set_property -dict {CONFIG.DIN_FROM 4 CONFIG.DIN_TO 4 CONFIG.DIN_WIDTH 16 CONFIG.DOUT_WIDTH 1} [get_bd_cells xlslice_4]
create_bd_cell -type ip -vlnv xilinx.com:ip:axi_gpio:2.0 axi_gpio
set_property -dict {CONFIG.C_ALL_OUTPUTS 1 CONFIG.C_GPIO_WIDTH 16} [get_bd_cells axi_gpio]
create_bd_cell -type ip -vlnv xilinx.com:ip:xlslice:1.0 xlslice_8_10
set_property -dict {CONFIG.DIN_FROM 10 CONFIG.DIN_TO 8 CONFIG.DIN_WIDTH 16 CONFIG.DOUT_WIDTH 3} [get_bd_cells xlslice_8_10]
create_bd_cell -type ip -vlnv xilinx.com:ip:xlslice:1.0 xlslice_5
set_property -dict {CONFIG.DIN_FROM 5 CONFIG.DIN_TO 5 CONFIG.DIN_WIDTH 16 CONFIG.DOUT_WIDTH 1} [get_bd_cells xlslice_5]

# ---- connections ----

current_bd_instance /camif_ias1
connect_bd_intf_net [get_bd_intf_pins s_axi_ctrl_mipi_rx] [get_bd_intf_pins mipi_rx_to_video/S00_AXI]
connect_bd_intf_net [get_bd_intf_pins axis_subset_converter/M_AXIS] [get_bd_intf_pins v_frm_wr/s_axis_video]
connect_bd_intf_net [get_bd_intf_pins mipi_rx_dphy_if] [get_bd_intf_pins mipi_rx_to_video/mipi_rx]
connect_bd_intf_net [get_bd_intf_pins mipi_rx_to_video/video] [get_bd_intf_pins video_to_axis/vid_in]
connect_bd_intf_net [get_bd_intf_pins s_axi_ctrl_wr] [get_bd_intf_pins v_frm_wr/s_axi_CTRL]
connect_bd_intf_net [get_bd_intf_pins m_axi_mm_wr] [get_bd_intf_pins v_frm_wr/m_axi_mm_video]
connect_bd_intf_net [get_bd_intf_pins video_to_axis/m_axis] [get_bd_intf_pins axis_subset_converter/S_AXIS]
connect_bd_net -net aclk_0_1 [get_bd_pins axi_ctrl_aclk] [get_bd_pins mipi_rx_to_video/s00_axi_aclk]
connect_bd_net -net aclk_0_2 [get_bd_pins axi_mm_aclk] \
  [get_bd_pins video_to_axis/aclk] [get_bd_pins axis_subset_converter/aclk] [get_bd_pins v_frm_wr/ap_clk]
connect_bd_net -net aresetn_0_1 [get_bd_pins axi_mm_arstn] [get_bd_pins video_to_axis/aresetn] [get_bd_pins axis_subset_converter/aresetn]
connect_bd_net [get_bd_pins axi_arstn_wr] [get_bd_pins v_frm_wr/ap_rst_n]
connect_bd_net [get_bd_pins axi_ctrl_arstn] [get_bd_pins mipi_rx_to_video/s00_axi_aresetn]
connect_bd_net -net mipi_rx_to_video_ias1_irq [get_bd_pins mipi_rx_to_video/irq] [get_bd_pins irq_mipi_rx]
connect_bd_net [get_bd_pins mipi_rx_to_video/vid_ce] [get_bd_pins video_to_axis/vid_ce]
connect_bd_net [get_bd_pins mipi_rx_to_video/vid_clk] [get_bd_pins video_to_axis/vid_clk]
connect_bd_net [get_bd_pins mipi_rx_to_video/vid_locked] [get_bd_pins video_to_axis/vid_rstn]
connect_bd_net -net v_frmbuf_wr_0_interrupt [get_bd_pins v_frm_wr/interrupt] [get_bd_pins irq_wr]

current_bd_instance /isp_pipe
connect_bd_intf_net [get_bd_intf_pins s_axi_ctrl_vip_2] [get_bd_intf_pins vip_2/S00_AXI]
connect_bd_intf_net [get_bd_intf_pins s_axi_ctrl_wr_2] [get_bd_intf_pins v_frm_wr_2/s_axi_CTRL]
connect_bd_intf_net [get_bd_intf_pins m_axi_mm_wr_2] [get_bd_intf_pins v_frm_wr_2/m_axi_mm_video]
connect_bd_intf_net [get_bd_intf_pins axis_to_video/vid_out] [get_bd_intf_pins isp/raw]
connect_bd_intf_net [get_bd_intf_pins isp/yuv] [get_bd_intf_pins vip_1/yuv]
connect_bd_intf_net [get_bd_intf_pins vip_2/yuv] [get_bd_intf_pins isp/yuv_aux1]
connect_bd_intf_net [get_bd_intf_pins s_axi_ctrl_rd] [get_bd_intf_pins v_frm_rd/s_axi_CTRL]
connect_bd_intf_net [get_bd_intf_pins s_axi_ctrl_isp] [get_bd_intf_pins isp/S00_AXI]
connect_bd_intf_net [get_bd_intf_pins s_axi_ctrl_vip_1] [get_bd_intf_pins vip_1/S00_AXI]
connect_bd_intf_net [get_bd_intf_pins s_axi_ctrl_wr_1] [get_bd_intf_pins v_frm_wr_1/s_axi_CTRL]
connect_bd_intf_net [get_bd_intf_pins m_axi_mm_rd] [get_bd_intf_pins v_frm_rd/m_axi_mm_video]
connect_bd_intf_net [get_bd_intf_pins v_frm_rd/m_axis_video] [get_bd_intf_pins axis_to_video/s_axis]
connect_bd_intf_net [get_bd_intf_pins m_axi_mm_wr_1] [get_bd_intf_pins v_frm_wr_1/m_axi_mm_video]
connect_bd_intf_net [get_bd_intf_pins video_to_axis_1/m_axis] [get_bd_intf_pins v_frm_wr_1/s_axis_video]
connect_bd_intf_net [get_bd_intf_pins video_to_axis_2/m_axis] [get_bd_intf_pins v_frm_wr_2/s_axis_video]
connect_bd_intf_net [get_bd_intf_pins vip_2/rgb] [get_bd_intf_pins video_to_axis_2/vid_in]
connect_bd_intf_net [get_bd_intf_pins vip_1/rgb] [get_bd_intf_pins video_to_axis_1/vid_in]
connect_bd_net [get_bd_pins axi_arstn_rd] [get_bd_pins v_frm_rd/ap_rst_n]
connect_bd_net -net axi_arstn_wr_1_1 [get_bd_pins axi_arstn_wr_1] [get_bd_pins v_frm_wr_1/ap_rst_n]
connect_bd_net -net axi_arstn_wr_2_1 [get_bd_pins axi_arstn_wr_2] [get_bd_pins v_frm_wr_2/ap_rst_n]
connect_bd_net [get_bd_pins axi_ctrl_arstn] [get_bd_pins vip_1/s00_axi_aresetn] [get_bd_pins isp/s00_axi_aresetn] [get_bd_pins vip_2/s00_axi_aresetn]
connect_bd_net -net axis_to_video_0_locked [get_bd_pins axis_to_video/locked] \
  [get_bd_pins video_to_axis_1/vid_rstn] [get_bd_pins video_to_axis_1/vid_ce] [get_bd_pins vip_1/rst_n] \
  [get_bd_pins isp/rst_n] [get_bd_pins vip_2/rst_n] [get_bd_pins video_to_axis_2/vid_rstn] \
  [get_bd_pins video_to_axis_2/vid_ce]
connect_bd_net [get_bd_pins isp/irq] [get_bd_pins irq_isp]
connect_bd_net -net rst_ps8_0_99M_peripheral_aresetn [get_bd_pins axi_mm_arstn] \
  [get_bd_pins axis_to_video/aresetn] [get_bd_pins video_to_axis_1/aresetn] [get_bd_pins video_to_axis_2/aresetn]
connect_bd_net -net s00_axi_aclk_0_1 [get_bd_pins axi_ctrl_aclk] \
  [get_bd_pins vip_1/s00_axi_aclk] [get_bd_pins isp/s00_axi_aclk] [get_bd_pins vip_2/s00_axi_aclk]
connect_bd_net -net v_frm_rd_0_interrupt [get_bd_pins v_frm_rd/interrupt] [get_bd_pins irq_rd]
connect_bd_net [get_bd_pins v_frm_wr_1/interrupt] [get_bd_pins irq_wr_1]
connect_bd_net [get_bd_pins v_frm_wr_2/interrupt] [get_bd_pins irq_wr_2]
connect_bd_net [get_bd_pins vid_rstn] [get_bd_pins axis_to_video/vid_rstn]
connect_bd_net [get_bd_pins vip_2/irq] [get_bd_pins irq_vip_2]
connect_bd_net [get_bd_pins vip_2/out_pclk] [get_bd_pins video_to_axis_2/vid_clk]
connect_bd_net -net vip_irq [get_bd_pins vip_1/irq] [get_bd_pins irq_vip_1]
connect_bd_net -net vip_out_pclk [get_bd_pins vip_1/out_pclk] [get_bd_pins video_to_axis_1/vid_clk]
connect_bd_net -net zynq_ultra_ps_e_0_pl_clk0 [get_bd_pins axi_mm_aclk] \
  [get_bd_pins axis_to_video/aclk] [get_bd_pins v_frm_rd/ap_clk] [get_bd_pins v_frm_wr_1/ap_clk] \
  [get_bd_pins video_to_axis_1/aclk] [get_bd_pins video_to_axis_2/aclk] [get_bd_pins v_frm_wr_2/ap_clk]
connect_bd_net -net zynq_ultra_ps_e_0_pl_clk1 [get_bd_pins vid_pclk] \
  [get_bd_pins axis_to_video/vid_clk] [get_bd_pins vip_1/pclk] [get_bd_pins isp/pclk] [get_bd_pins vip_2/pclk]

current_bd_instance /camif_rpi
connect_bd_intf_net [get_bd_intf_pins s_axi_ctrl_mipi_rx] [get_bd_intf_pins mipi_rx_to_video/S00_AXI]
connect_bd_intf_net [get_bd_intf_pins axis_subset_converter/M_AXIS] [get_bd_intf_pins v_frm_wr/s_axis_video]
connect_bd_intf_net [get_bd_intf_pins mipi_rx_dphy_if] [get_bd_intf_pins mipi_rx_to_video/mipi_rx]
connect_bd_intf_net [get_bd_intf_pins mipi_rx_to_video/video] [get_bd_intf_pins video_to_axis/vid_in]
connect_bd_intf_net [get_bd_intf_pins s_axi_ctrl_wr] [get_bd_intf_pins v_frm_wr/s_axi_CTRL]
connect_bd_intf_net [get_bd_intf_pins m_axi_mm_wr] [get_bd_intf_pins v_frm_wr/m_axi_mm_video]
connect_bd_intf_net [get_bd_intf_pins video_to_axis/m_axis] [get_bd_intf_pins axis_subset_converter/S_AXIS]
connect_bd_net -net aclk_0_1 [get_bd_pins axi_mm_aclk] \
  [get_bd_pins axis_subset_converter/aclk] [get_bd_pins v_frm_wr/ap_clk] [get_bd_pins video_to_axis/aclk]
connect_bd_net -net aresetn_1 [get_bd_pins axi_mm_arstn] [get_bd_pins axis_subset_converter/aresetn] [get_bd_pins video_to_axis/aresetn]
connect_bd_net [get_bd_pins axi_arstn_wr] [get_bd_pins v_frm_wr/ap_rst_n]
connect_bd_net [get_bd_pins axi_ctrl_arstn] [get_bd_pins mipi_rx_to_video/s00_axi_aresetn]
connect_bd_net -net mipi_rx_to_video_rpi_irq [get_bd_pins mipi_rx_to_video/irq] [get_bd_pins irq_mipi_rx]
connect_bd_net [get_bd_pins mipi_rx_to_video/vid_ce] [get_bd_pins video_to_axis/vid_ce]
connect_bd_net [get_bd_pins mipi_rx_to_video/vid_clk] [get_bd_pins video_to_axis/vid_clk]
connect_bd_net [get_bd_pins mipi_rx_to_video/vid_locked] [get_bd_pins video_to_axis/vid_rstn]
connect_bd_net -net s00_axi_aclk_0_1 [get_bd_pins axi_ctrl_aclk] [get_bd_pins mipi_rx_to_video/s00_axi_aclk]
connect_bd_net -net v_frmbuf_wr_0_interrupt [get_bd_pins v_frm_wr/interrupt] [get_bd_pins irq_wr]

current_bd_instance /gpio_slice
connect_bd_intf_net [get_bd_intf_pins s_axi_ctrl] [get_bd_intf_pins axi_gpio/S_AXI]
connect_bd_net [get_bd_pins axi_ctrl_arstn] [get_bd_pins axi_gpio/s_axi_aresetn]
connect_bd_net [get_bd_pins axi_gpio/gpio_io_o] \
  [get_bd_pins xlslice_0/Din] [get_bd_pins xlslice_1/Din] [get_bd_pins xlslice_2/Din] [get_bd_pins xlslice_3/Din] \
  [get_bd_pins xlslice_8_10/Din] [get_bd_pins xlslice_4/Din] [get_bd_pins xlslice_5/Din]
connect_bd_net -net s_axi_aclk_0_1 [get_bd_pins axi_ctrl_aclk] [get_bd_pins axi_gpio/s_axi_aclk]
connect_bd_net [get_bd_pins xlslice_0/Dout] [get_bd_pins Dout_0]
connect_bd_net [get_bd_pins xlslice_1/Dout] [get_bd_pins Dout_1]
connect_bd_net [get_bd_pins xlslice_2/Dout] [get_bd_pins Dout_2]
connect_bd_net [get_bd_pins xlslice_3/Dout] [get_bd_pins Dout_3]
connect_bd_net -net xlslice_4_Dout [get_bd_pins xlslice_8_10/Dout] [get_bd_pins Dout_8_10]
connect_bd_net [get_bd_pins xlslice_4/Dout] [get_bd_pins Dout_4]
connect_bd_net [get_bd_pins xlslice_5/Dout] [get_bd_pins Dout_5]

current_bd_instance /
connect_bd_intf_net [get_bd_intf_ports iic] [get_bd_intf_pins axi_iic/IIC]
connect_bd_intf_net [get_bd_intf_pins axi_smc_vcu_1/M00_AXI] [get_bd_intf_pins zynq_ultra_ps_e_0/S_AXI_HP0_FPD]
connect_bd_intf_net [get_bd_intf_pins axi_smc_vcu_2/M00_AXI] [get_bd_intf_pins zynq_ultra_ps_e_0/S_AXI_HP1_FPD]
connect_bd_intf_net [get_bd_intf_pins axi_smc_vcu_0/M00_AXI] [get_bd_intf_pins zynq_ultra_ps_e_0/S_AXI_HPC0_FPD]
connect_bd_intf_net [get_bd_intf_pins axi_smc_cam/M00_AXI] [get_bd_intf_pins zynq_ultra_ps_e_0/S_AXI_HP2_FPD]
connect_bd_intf_net [get_bd_intf_pins camif_ias1/m_axi_mm_wr] [get_bd_intf_pins axi_smc_cam/S03_AXI]
connect_bd_intf_net [get_bd_intf_pins camif_rpi/m_axi_mm_wr] [get_bd_intf_pins axi_smc_cam/S04_AXI]
connect_bd_intf_net [get_bd_intf_pins isp_pipe/m_axi_mm_rd] [get_bd_intf_pins axi_smc_cam/S00_AXI]
connect_bd_intf_net [get_bd_intf_pins isp_pipe/m_axi_mm_wr_1] [get_bd_intf_pins axi_smc_cam/S01_AXI]
connect_bd_intf_net [get_bd_intf_pins isp_pipe/m_axi_mm_wr_2] [get_bd_intf_pins axi_smc_cam/S02_AXI]
connect_bd_intf_net [get_bd_intf_ports mipi_rx_ias1] [get_bd_intf_pins camif_ias1/mipi_rx_dphy_if]
connect_bd_intf_net [get_bd_intf_ports mipi_rx_rpi] [get_bd_intf_pins camif_rpi/mipi_rx_dphy_if]
connect_bd_intf_net [get_bd_intf_pins ps8_0_axi_periph_1/M00_AXI] [get_bd_intf_pins isp_pipe/s_axi_ctrl_rd]
connect_bd_intf_net [get_bd_intf_pins ps8_0_axi_periph_1/M01_AXI] [get_bd_intf_pins isp_pipe/s_axi_ctrl_wr_1]
connect_bd_intf_net [get_bd_intf_pins ps8_0_axi_periph_1/M02_AXI] [get_bd_intf_pins isp_pipe/s_axi_ctrl_wr_2]
connect_bd_intf_net [get_bd_intf_pins ps8_0_axi_periph_1/M03_AXI] [get_bd_intf_pins camif_ias1/s_axi_ctrl_wr]
connect_bd_intf_net [get_bd_intf_pins ps8_0_axi_periph_1/M04_AXI] [get_bd_intf_pins camif_rpi/s_axi_ctrl_wr]
connect_bd_intf_net [get_bd_intf_pins ps8_0_axi_periph/M00_AXI] [get_bd_intf_pins axi_intc/s_axi]
connect_bd_intf_net [get_bd_intf_pins ps8_0_axi_periph/M01_AXI] [get_bd_intf_pins axi_iic/S_AXI]
connect_bd_intf_net [get_bd_intf_pins ps8_0_axi_periph/M02_AXI] [get_bd_intf_pins gpio_slice/s_axi_ctrl]
connect_bd_intf_net [get_bd_intf_pins ps8_0_axi_periph/M03_AXI] [get_bd_intf_pins vcu/S_AXI_LITE]
connect_bd_intf_net [get_bd_intf_pins ps8_0_axi_periph/M04_AXI] [get_bd_intf_pins isp_pipe/s_axi_ctrl_isp]
connect_bd_intf_net [get_bd_intf_pins ps8_0_axi_periph/M05_AXI] [get_bd_intf_pins isp_pipe/s_axi_ctrl_vip_1]
connect_bd_intf_net [get_bd_intf_pins ps8_0_axi_periph/M06_AXI] [get_bd_intf_pins isp_pipe/s_axi_ctrl_vip_2]
connect_bd_intf_net [get_bd_intf_pins ps8_0_axi_periph/M07_AXI] [get_bd_intf_pins camif_ias1/s_axi_ctrl_mipi_rx]
connect_bd_intf_net [get_bd_intf_pins ps8_0_axi_periph/M08_AXI] [get_bd_intf_pins camif_rpi/s_axi_ctrl_mipi_rx]
connect_bd_intf_net [get_bd_intf_pins vcu/M_AXI_DEC0] [get_bd_intf_pins axi_smc_vcu_2/S00_AXI]
connect_bd_intf_net [get_bd_intf_pins vcu/M_AXI_DEC1] [get_bd_intf_pins axi_smc_vcu_2/S01_AXI]
connect_bd_intf_net [get_bd_intf_pins vcu/M_AXI_ENC0] [get_bd_intf_pins axi_smc_vcu_1/S00_AXI]
connect_bd_intf_net [get_bd_intf_pins vcu/M_AXI_ENC1] [get_bd_intf_pins axi_smc_vcu_1/S01_AXI]
connect_bd_intf_net [get_bd_intf_pins vcu/M_AXI_MCU] [get_bd_intf_pins axi_smc_vcu_0/S00_AXI]
connect_bd_intf_net [get_bd_intf_pins zynq_ultra_ps_e_0/M_AXI_HPM0_FPD] [get_bd_intf_pins ps8_0_axi_periph/S00_AXI]
connect_bd_intf_net [get_bd_intf_pins zynq_ultra_ps_e_0/M_AXI_HPM1_FPD] [get_bd_intf_pins ps8_0_axi_periph_1/S00_AXI]
connect_bd_net -net axi_arstn_wr_1 [get_bd_pins gpio_slice/Dout_4] [get_bd_pins camif_ias1/axi_arstn_wr]
connect_bd_net -net axi_arstn_wr_2 [get_bd_pins gpio_slice/Dout_5] [get_bd_pins camif_rpi/axi_arstn_wr]
connect_bd_net [get_bd_pins axi_iic/iic2intc_irpt] [get_bd_pins xlconcat_0/In0]
connect_bd_net -net axi_intc_0_irq [get_bd_pins axi_intc/irq] [get_bd_pins zynq_ultra_ps_e_0/pl_ps_irq0]
connect_bd_net [get_bd_pins camif_ias1/irq_mipi_rx] [get_bd_pins xlconcat_0/In8]
connect_bd_net [get_bd_pins camif_ias1/irq_wr] [get_bd_pins xlconcat_0/In9]
connect_bd_net [get_bd_pins camif_rpi/irq_mipi_rx] [get_bd_pins xlconcat_0/In10]
connect_bd_net [get_bd_pins camif_rpi/irq_wr] [get_bd_pins xlconcat_0/In11]
connect_bd_net [get_bd_pins clk_wiz/clk_ctrl] \
  [get_bd_pins ps8_0_axi_periph/ACLK] [get_bd_pins zynq_ultra_ps_e_0/maxihpm0_fpd_aclk] \
  [get_bd_pins ps8_0_axi_periph/S00_ACLK] [get_bd_pins rst_clk_wiz_ctrl/slowest_sync_clk] [get_bd_pins axi_intc/s_axi_aclk] \
  [get_bd_pins ps8_0_axi_periph/M00_ACLK] [get_bd_pins axi_iic/s_axi_aclk] [get_bd_pins ps8_0_axi_periph/M01_ACLK] \
  [get_bd_pins gpio_slice/axi_ctrl_aclk] [get_bd_pins ps8_0_axi_periph/M02_ACLK] [get_bd_pins vcu/s_axi_lite_aclk] \
  [get_bd_pins ps8_0_axi_periph/M03_ACLK] [get_bd_pins isp_pipe/axi_ctrl_aclk] [get_bd_pins ps8_0_axi_periph/M04_ACLK] \
  [get_bd_pins ps8_0_axi_periph/M05_ACLK] [get_bd_pins ps8_0_axi_periph/M06_ACLK] [get_bd_pins camif_ias1/axi_ctrl_aclk] \
  [get_bd_pins ps8_0_axi_periph/M07_ACLK] [get_bd_pins camif_rpi/axi_ctrl_aclk] [get_bd_pins ps8_0_axi_periph/M08_ACLK]
connect_bd_net [get_bd_pins clk_wiz/clk_isp] [get_bd_pins isp_pipe/vid_pclk] [get_bd_pins rst_clk_wiz_isp/slowest_sync_clk]
connect_bd_net [get_bd_pins clk_wiz/clk_mm] \
  [get_bd_pins axi_smc_vcu_0/aclk] [get_bd_pins vcu/m_axi_mcu_aclk] [get_bd_pins zynq_ultra_ps_e_0/saxihpc0_fpd_aclk] \
  [get_bd_pins rst_clk_wiz_mm/slowest_sync_clk] [get_bd_pins axi_smc_vcu_1/aclk] [get_bd_pins vcu/m_axi_enc_aclk] \
  [get_bd_pins zynq_ultra_ps_e_0/saxihp0_fpd_aclk] [get_bd_pins axi_smc_vcu_2/aclk] [get_bd_pins vcu/m_axi_dec_aclk] \
  [get_bd_pins zynq_ultra_ps_e_0/saxihp1_fpd_aclk] [get_bd_pins ps8_0_axi_periph_1/ACLK] \
  [get_bd_pins zynq_ultra_ps_e_0/maxihpm1_fpd_aclk] [get_bd_pins ps8_0_axi_periph_1/S00_ACLK] \
  [get_bd_pins isp_pipe/axi_mm_aclk] [get_bd_pins ps8_0_axi_periph_1/M00_ACLK] [get_bd_pins ps8_0_axi_periph_1/M01_ACLK] \
  [get_bd_pins ps8_0_axi_periph_1/M02_ACLK] [get_bd_pins zynq_ultra_ps_e_0/saxihp2_fpd_aclk] [get_bd_pins axi_smc_cam/aclk] \
  [get_bd_pins camif_ias1/axi_mm_aclk] [get_bd_pins ps8_0_axi_periph_1/M03_ACLK] [get_bd_pins ps8_0_axi_periph_1/M04_ACLK] \
  [get_bd_pins camif_rpi/axi_mm_aclk]
connect_bd_net [get_bd_pins clk_wiz/clk_vcu] [get_bd_pins vcu/pll_ref_clk]
connect_bd_net [get_bd_pins gpio_slice/Dout_0] [get_bd_pins vcu/vcu_resetn]
connect_bd_net [get_bd_pins gpio_slice/Dout_1] [get_bd_pins isp_pipe/axi_arstn_rd]
connect_bd_net [get_bd_pins gpio_slice/Dout_2] [get_bd_pins isp_pipe/axi_arstn_wr_1]
connect_bd_net [get_bd_pins gpio_slice/Dout_3] [get_bd_pins isp_pipe/axi_arstn_wr_2]
connect_bd_net [get_bd_pins isp_pipe/irq_isp] [get_bd_pins xlconcat_0/In3]
connect_bd_net [get_bd_pins isp_pipe/irq_rd] [get_bd_pins xlconcat_0/In2]
connect_bd_net [get_bd_pins isp_pipe/irq_vip_1] [get_bd_pins xlconcat_0/In4]
connect_bd_net [get_bd_pins isp_pipe/irq_vip_2] [get_bd_pins xlconcat_0/In6]
connect_bd_net [get_bd_pins isp_pipe/irq_wr_1] [get_bd_pins xlconcat_0/In5]
connect_bd_net [get_bd_pins isp_pipe/irq_wr_2] [get_bd_pins xlconcat_0/In7]
connect_bd_net -net rst_clk_wiz_299M_peripheral_aresetn [get_bd_pins rst_clk_wiz_mm/peripheral_aresetn] \
  [get_bd_pins axi_smc_vcu_0/aresetn] [get_bd_pins axi_smc_vcu_1/aresetn] [get_bd_pins axi_smc_vcu_2/aresetn] \
  [get_bd_pins ps8_0_axi_periph_1/S00_ARESETN] [get_bd_pins ps8_0_axi_periph_1/M00_ARESETN] \
  [get_bd_pins ps8_0_axi_periph_1/ARESETN] [get_bd_pins isp_pipe/axi_mm_arstn] [get_bd_pins ps8_0_axi_periph_1/M01_ARESETN] \
  [get_bd_pins ps8_0_axi_periph_1/M02_ARESETN] [get_bd_pins axi_smc_cam/aresetn] [get_bd_pins ps8_0_axi_periph_1/M03_ARESETN] \
  [get_bd_pins camif_ias1/axi_mm_arstn] [get_bd_pins ps8_0_axi_periph_1/M04_ARESETN] [get_bd_pins camif_rpi/axi_mm_arstn]
connect_bd_net -net rst_clk_wiz_99M_peripheral_aresetn [get_bd_pins rst_clk_wiz_ctrl/peripheral_aresetn] \
  [get_bd_pins ps8_0_axi_periph/S00_ARESETN] [get_bd_pins axi_intc/s_axi_aresetn] [get_bd_pins ps8_0_axi_periph/M00_ARESETN] \
  [get_bd_pins ps8_0_axi_periph/ARESETN] [get_bd_pins axi_iic/s_axi_aresetn] [get_bd_pins ps8_0_axi_periph/M01_ARESETN] \
  [get_bd_pins gpio_slice/axi_ctrl_arstn] [get_bd_pins ps8_0_axi_periph/M02_ARESETN] \
  [get_bd_pins ps8_0_axi_periph/M03_ARESETN] [get_bd_pins isp_pipe/axi_ctrl_arstn] [get_bd_pins ps8_0_axi_periph/M04_ARESETN] \
  [get_bd_pins ps8_0_axi_periph/M05_ARESETN] [get_bd_pins ps8_0_axi_periph/M06_ARESETN] \
  [get_bd_pins camif_ias1/axi_ctrl_arstn] [get_bd_pins ps8_0_axi_periph/M07_ARESETN] [get_bd_pins camif_rpi/axi_ctrl_arstn] \
  [get_bd_pins ps8_0_axi_periph/M08_ARESETN]
connect_bd_net [get_bd_pins rst_clk_wiz_isp/peripheral_aresetn] [get_bd_pins isp_pipe/vid_rstn]
connect_bd_net [get_bd_pins vcu/vcu_host_interrupt] [get_bd_pins xlconcat_0/In1]
connect_bd_net [get_bd_pins xlconcat_0/dout] [get_bd_pins axi_intc/intr]
connect_bd_net -net xlslice_4_Dout [get_bd_pins gpio_slice/Dout_8_10] [get_bd_ports gpio]
connect_bd_net [get_bd_pins zynq_ultra_ps_e_0/pl_clk0] [get_bd_pins clk_wiz/clk_in1]
connect_bd_net [get_bd_pins zynq_ultra_ps_e_0/pl_resetn0] \
  [get_bd_pins rst_clk_wiz_ctrl/ext_reset_in] [get_bd_pins rst_clk_wiz_mm/ext_reset_in] \
  [get_bd_pins rst_clk_wiz_isp/ext_reset_in]
